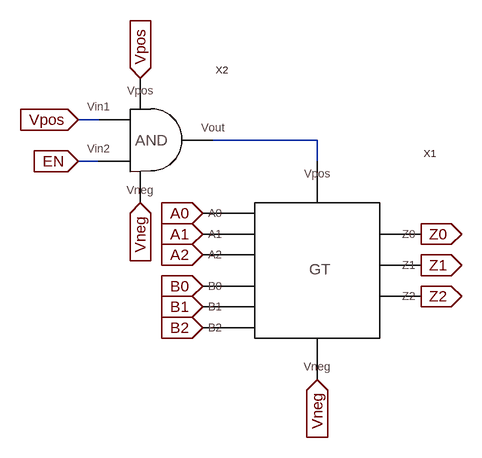
[diagram p0: schematic GT_EN_SYM.asc]
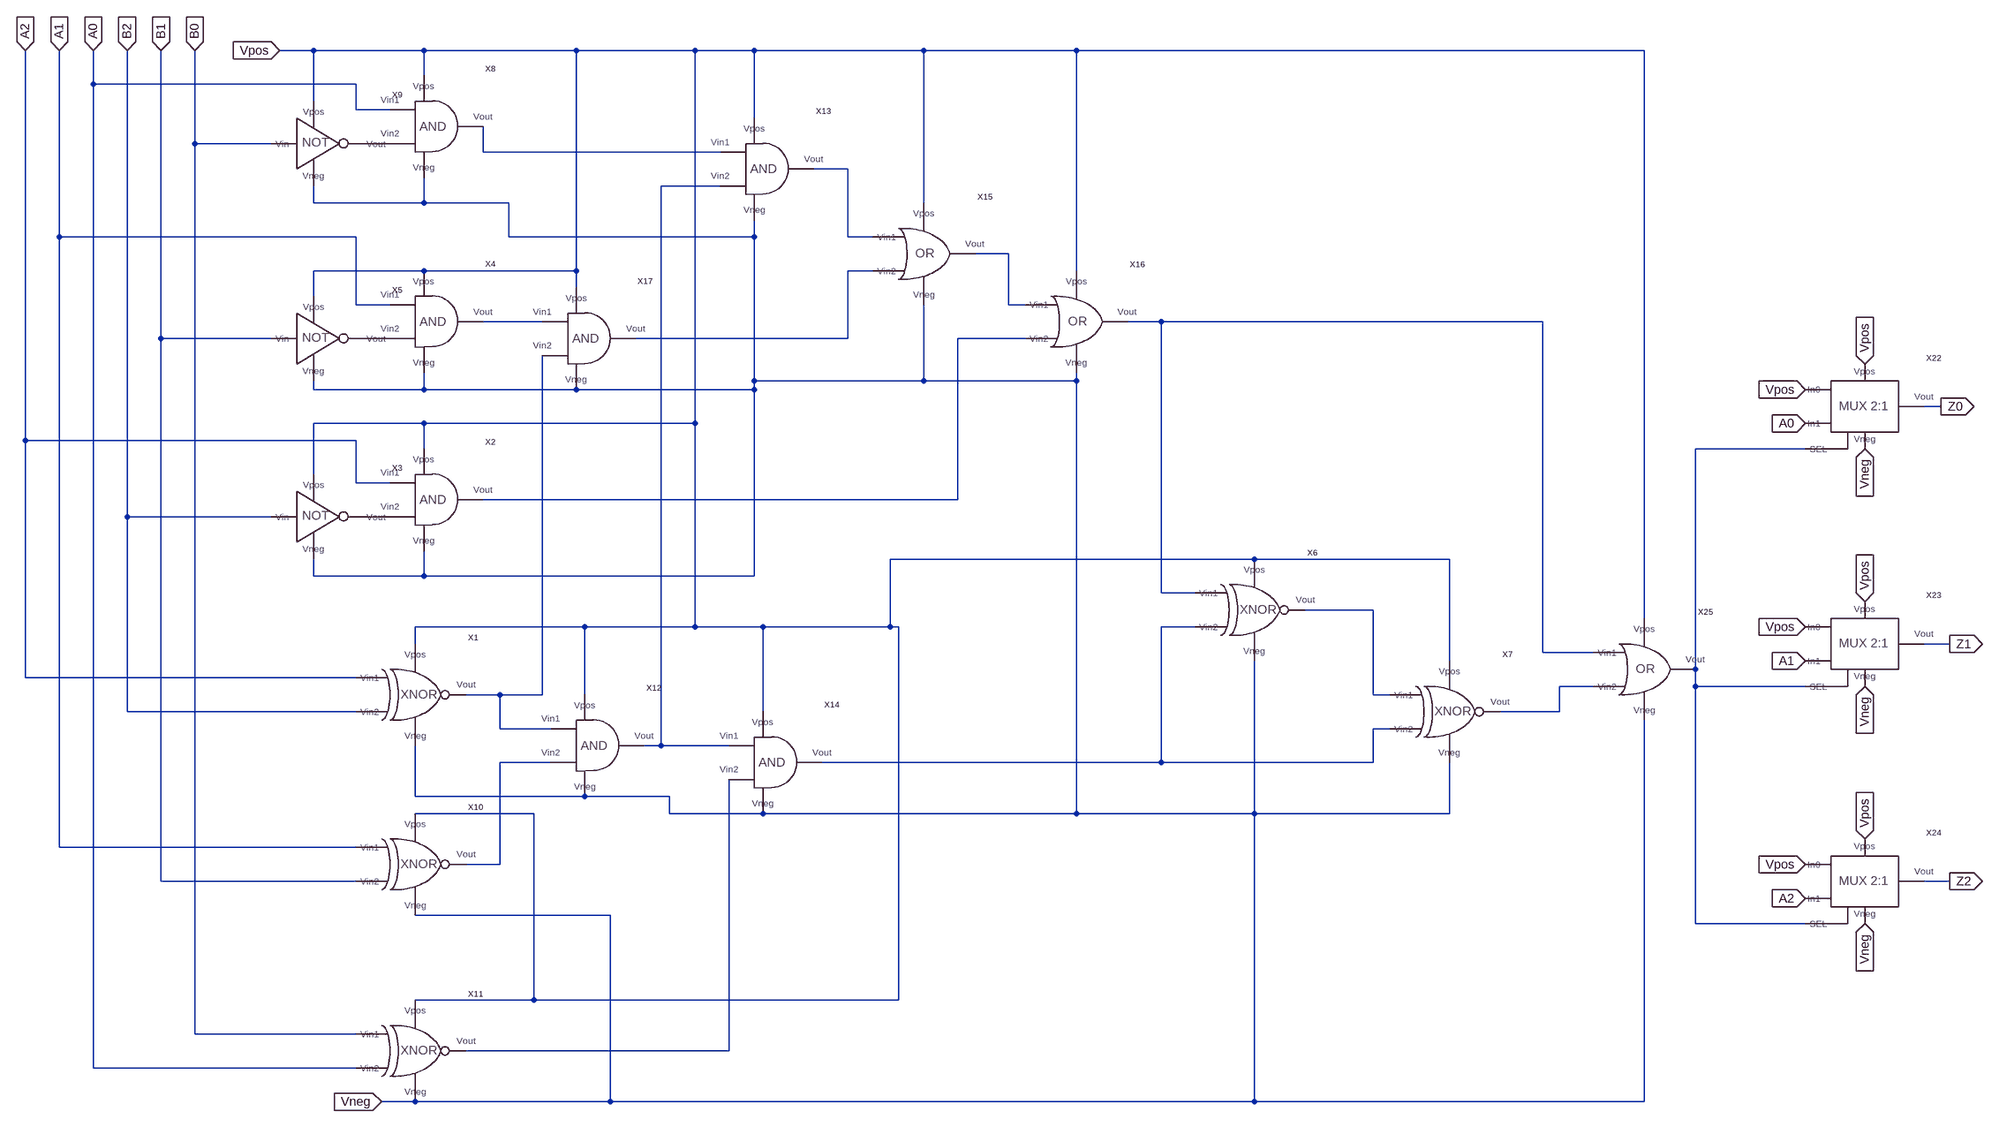
[diagram p1: sub-circuit gt_sym.asc]
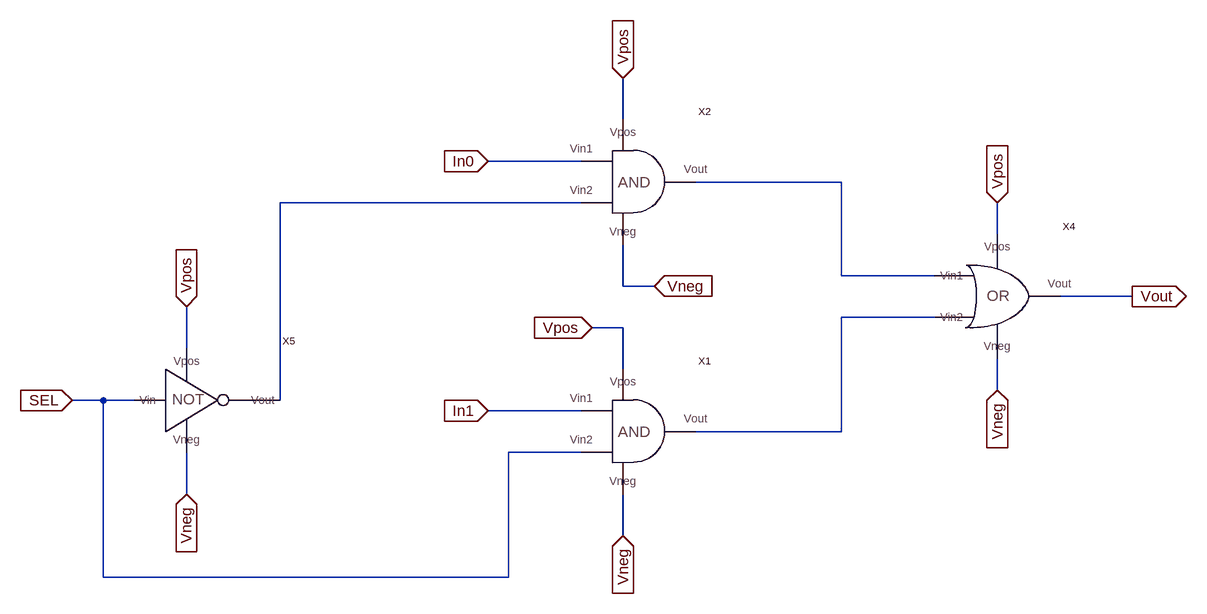
[diagram p2: sub-circuit mux2_1.asc]
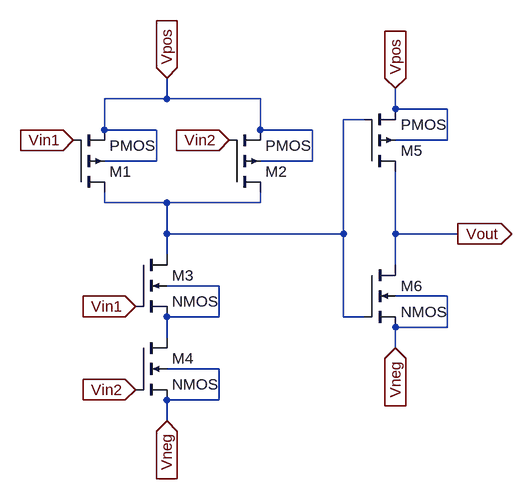
[diagram p3: sub-circuit and_sym.asc]
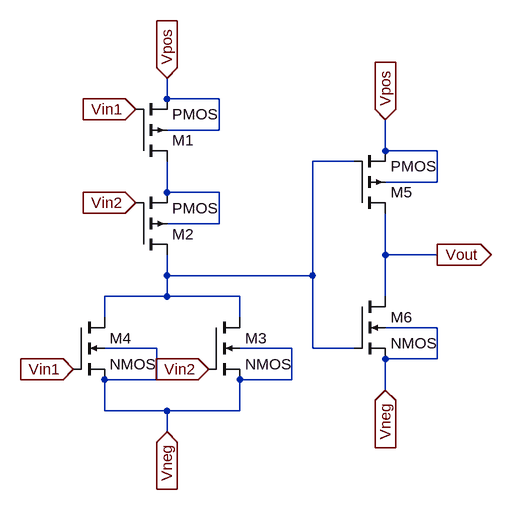
[diagram p4: sub-circuit or_sym.asc]
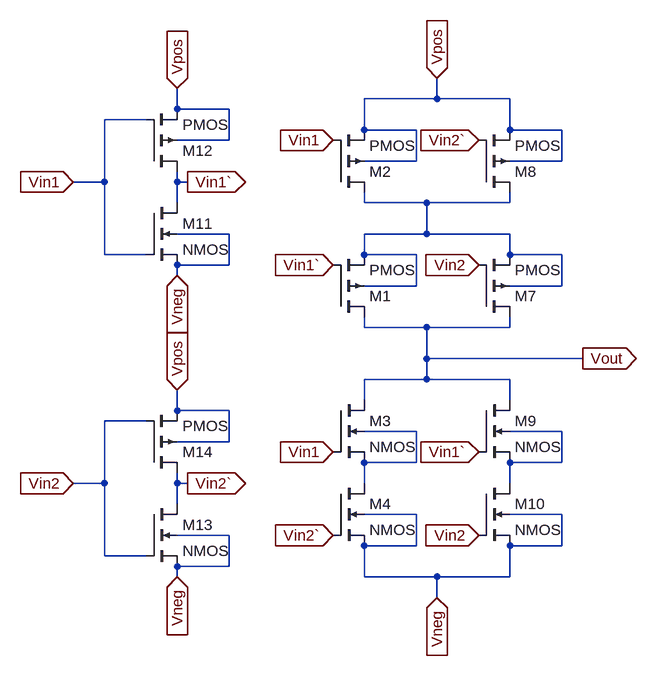
[diagram p5: sub-circuit xnor_sym.asc]
GT_EN_SYM.asc, the LTspice schematic file:
Version 4
SHEET 1 880 680
WIRE -48 -32 -80 -32
WIRE 288 0 128 0
WIRE -48 32 -80 32
WIRE 288 32 288 0
FLAG 112 112 A0
IOPIN 112 112 In
FLAG 112 144 A1
IOPIN 112 144 In
FLAG 112 176 A2
IOPIN 112 176 In
FLAG 112 224 B0
IOPIN 112 224 In
FLAG 112 256 B1
IOPIN 112 256 In
FLAG 112 288 B2
IOPIN 112 288 In
FLAG 288 368 Vneg
IOPIN 288 368 In
FLAG -80 -32 Vpos
IOPIN -80 -32 In
FLAG -80 32 EN
IOPIN -80 32 In
FLAG 16 -96 Vpos
IOPIN 16 -96 In
FLAG 16 96 Vneg
IOPIN 16 96 In
FLAG 448 144 Z0
IOPIN 448 144 Out
FLAG 448 192 Z1
IOPIN 448 192 Out
FLAG 448 240 Z2
IOPIN 448 240 Out
SYMBOL GT_SYM 288 208 R0
SYMATTR InstName X1
SYMBOL AND_SYM 32 0 R0
SYMATTR InstName X2

gt_sym.asc, the sub-circuit schematic file:
Version 4
SHEET 1 3832 2184
WIRE -32 128 -96 128
WIRE 176 128 -32 128
WIRE 464 128 176 128
WIRE 688 128 464 128
WIRE 800 128 688 128
WIRE 1120 128 800 128
WIRE 1408 128 1120 128
WIRE 2480 128 1408 128
WIRE 176 176 176 128
WIRE -448 192 -448 128
WIRE 48 192 -448 192
WIRE -32 224 -32 128
WIRE 48 240 48 192
WIRE 112 240 48 240
WIRE 800 256 800 128
WIRE -256 304 -256 128
WIRE -112 304 -256 304
WIRE 288 320 288 272
WIRE 736 320 288 320
WIRE 976 352 912 352
WIRE 736 384 624 384
WIRE -32 416 -32 384
WIRE 176 416 176 368
WIRE 176 416 -32 416
WIRE 336 416 176 416
WIRE 1120 416 1120 128
WIRE -512 480 -512 128
WIRE 48 480 -512 480
WIRE 336 480 336 416
WIRE 800 480 800 448
WIRE 800 480 336 480
WIRE 976 480 976 352
WIRE 1024 480 976 480
WIRE 1280 512 1216 512
WIRE 176 544 -32 544
WIRE 464 544 464 128
WIRE 464 544 176 544
WIRE 1024 544 976 544
WIRE 1408 544 1408 128
WIRE 464 576 464 544
WIRE -32 592 -32 544
WIRE 48 608 48 480
WIRE 112 608 48 608
WIRE 1280 608 1280 512
WIRE 1312 608 1280 608
WIRE 400 640 288 640
WIRE 1568 640 1504 640
WIRE 2288 640 1568 640
WIRE -320 672 -320 128
WIRE -112 672 -320 672
WIRE 976 672 976 544
WIRE 976 672 576 672
WIRE 1312 672 1184 672
WIRE 800 752 800 480
WIRE 1120 752 1120 608
WIRE 1120 752 800 752
WIRE 1408 752 1408 736
WIRE 1408 752 1120 752
WIRE -32 768 -32 752
WIRE 176 768 176 736
WIRE 176 768 -32 768
WIRE 464 768 176 768
WIRE 800 768 800 752
WIRE 800 768 464 768
WIRE 3040 800 3008 800
WIRE 176 832 -32 832
WIRE 688 832 688 128
WIRE 688 832 176 832
WIRE -576 864 -576 128
WIRE 48 864 -576 864
WIRE 176 880 176 832
WIRE 2784 880 2576 880
WIRE -32 928 -32 832
WIRE 48 944 48 864
WIRE 112 944 48 944
WIRE 1184 976 1184 672
WIRE 1184 976 288 976
WIRE -384 1008 -384 128
WIRE -112 1008 -384 1008
WIRE 1744 1088 1056 1088
WIRE 2112 1088 1744 1088
WIRE -32 1120 -32 1088
WIRE 176 1120 176 1072
WIRE 176 1120 -32 1120
WIRE 800 1120 800 768
WIRE 800 1120 176 1120
WIRE 1568 1152 1568 640
WIRE 1632 1152 1568 1152
WIRE 1968 1184 1840 1184
WIRE 2480 1200 2480 128
WIRE 480 1216 160 1216
WIRE 688 1216 688 832
WIRE 688 1216 480 1216
WIRE 816 1216 688 1216
WIRE 1056 1216 1056 1088
WIRE 1056 1216 816 1216
WIRE 1072 1216 1056 1216
WIRE 1632 1216 1568 1216
WIRE 160 1248 160 1216
WIRE 3056 1248 3008 1248
WIRE 2288 1264 2288 640
WIRE 2384 1264 2288 1264
WIRE 2112 1280 2112 1088
WIRE 2576 1296 2576 880
WIRE -576 1312 -576 864
WIRE 48 1312 -576 1312
WIRE 2384 1328 2320 1328
WIRE 2576 1328 2576 1296
WIRE 2784 1328 2576 1328
WIRE 320 1344 256 1344
WIRE 400 1344 400 704
WIRE 400 1344 320 1344
WIRE 480 1344 480 1216
WIRE 1968 1344 1968 1184
WIRE 2000 1344 1968 1344
WIRE -384 1376 -384 1008
WIRE 48 1376 -384 1376
WIRE 816 1376 816 1216
WIRE 2320 1376 2320 1328
WIRE 2320 1376 2208 1376
WIRE 320 1408 320 1344
WIRE 416 1408 320 1408
WIRE 2000 1408 1968 1408
WIRE 624 1440 624 384
WIRE 624 1440 592 1440
WIRE 752 1440 624 1440
WIRE 416 1472 320 1472
WIRE 1568 1472 1568 1216
WIRE 1568 1472 928 1472
WIRE 1968 1472 1968 1408
WIRE 1968 1472 1568 1472
WIRE 160 1536 160 1440
WIRE 480 1536 160 1536
WIRE 640 1536 480 1536
WIRE 384 1568 160 1568
WIRE 640 1568 640 1536
WIRE 816 1568 640 1568
WIRE 1408 1568 1408 752
WIRE 1408 1568 816 1568
WIRE 1744 1568 1744 1280
WIRE 1744 1568 1408 1568
WIRE 2112 1568 2112 1472
WIRE 2112 1568 1744 1568
WIRE -512 1632 -512 480
WIRE 48 1632 -512 1632
WIRE 320 1664 320 1472
WIRE 320 1664 256 1664
WIRE -320 1696 -320 672
WIRE 48 1696 -320 1696
WIRE 3056 1696 3008 1696
WIRE 528 1760 160 1760
WIRE 2576 1776 2576 1328
WIRE 2784 1776 2576 1776
WIRE 384 1920 384 1568
WIRE 384 1920 160 1920
WIRE 1072 1920 1072 1216
WIRE 1072 1920 384 1920
WIRE -256 1984 -256 304
WIRE 48 1984 -256 1984
WIRE 752 2016 752 1504
WIRE 752 2016 256 2016
WIRE -448 2048 -448 192
WIRE 48 2048 -448 2048
WIRE 160 2112 96 2112
WIRE 528 2112 528 1760
WIRE 528 2112 160 2112
WIRE 1744 2112 1744 1568
WIRE 1744 2112 528 2112
WIRE 2480 2112 2480 1392
WIRE 2480 2112 1744 2112
FLAG -576 128 A2
IOPIN -576 128 In
FLAG -512 128 A1
IOPIN -512 128 In
FLAG -448 128 A0
IOPIN -448 128 In
FLAG -384 128 B2
IOPIN -384 128 In
FLAG -320 128 B1
IOPIN -320 128 In
FLAG -256 128 B0
IOPIN -256 128 In
FLAG 3040 800 Z0
IOPIN 3040 800 Out
FLAG 3056 1248 Z1
IOPIN 3056 1248 Out
FLAG 3056 1696 Z2
IOPIN 3056 1696 Out
FLAG 2896 720 Vpos
IOPIN 2896 720 In
FLAG 2784 1728 A2
IOPIN 2784 1728 In
FLAG 2784 1280 A1
IOPIN 2784 1280 In
FLAG 2784 832 A0
IOPIN 2784 832 In
FLAG 2896 1168 Vpos
IOPIN 2896 1168 In
FLAG 2896 1616 Vpos
IOPIN 2896 1616 In
FLAG 2896 880 Vneg
IOPIN 2896 880 In
FLAG 2896 1328 Vneg
IOPIN 2896 1328 In
FLAG 2896 1776 Vneg
IOPIN 2896 1776 In
FLAG 2784 768 Vpos
IOPIN 2784 768 In
FLAG 2784 1216 Vpos
IOPIN 2784 1216 In
FLAG 2784 1664 Vpos
IOPIN 2784 1664 In
FLAG -96 128 Vpos
IOPIN -96 128 In
FLAG 96 2112 Vneg
IOPIN 96 2112 In
SYMBOL MUX2_1 2896 800 R0
SYMATTR InstName X22
SYMBOL MUX2_1 2896 1248 R0
SYMATTR InstName X23
SYMBOL MUX2_1 2896 1696 R0
SYMATTR InstName X24
SYMBOL OR_SYM 2496 1296 R0
SYMATTR InstName X25
SYMBOL XNOR_SYM 160 1344 R0
SYMATTR InstName X1
SYMBOL AND_SYM 192 976 R0
SYMATTR InstName X2
SYMBOL NOT_SYM -32 1008 R0
SYMATTR InstName X3
SYMBOL AND_SYM 192 640 R0
SYMATTR InstName X4
SYMBOL NOT_SYM -32 672 R0
SYMATTR InstName X5
SYMBOL AND_SYM 192 272 R0
SYMATTR InstName X8
SYMBOL NOT_SYM -32 304 R0
SYMATTR InstName X9
SYMBOL XNOR_SYM 160 1664 R0
SYMATTR InstName X10
SYMBOL XNOR_SYM 160 2016 R0
SYMATTR InstName X11
SYMBOL AND_SYM 496 1440 R0
SYMATTR InstName X12
SYMBOL AND_SYM 816 352 R0
SYMATTR InstName X13
SYMBOL AND_SYM 832 1472 R0
SYMATTR InstName X14
SYMBOL OR_SYM 1136 512 R0
SYMATTR InstName X15
SYMBOL OR_SYM 1424 640 R0
SYMATTR InstName X16
SYMBOL AND_SYM 480 672 R0
SYMATTR InstName X17
SYMBOL XNOR_SYM 1744 1184 R0
SYMATTR InstName X6
SYMBOL XNOR_SYM 2112 1376 R0
SYMATTR InstName X7

mux2_1.asc, the sub-circuit schematic file:
Version 4
SHEET 1 1072 680
WIRE 176 -352 176 -416
WIRE 112 -288 -32 -288
WIRE 512 -256 288 -256
WIRE 112 -224 -352 -224
WIRE 752 -176 752 -224
WIRE 512 -112 512 -256
WIRE 656 -112 512 -112
WIRE 176 -96 176 -160
WIRE 224 -96 176 -96
WIRE 960 -80 848 -80
WIRE 656 -48 512 -48
WIRE 176 -32 128 -32
WIRE -496 0 -496 -64
WIRE 176 32 176 -32
WIRE 752 64 752 16
WIRE -624 80 -672 80
WIRE -576 80 -624 80
WIRE -352 80 -352 -224
WIRE 112 96 -32 96
WIRE 512 128 512 -48
WIRE 512 128 288 128
WIRE 112 160 0 160
WIRE -496 224 -496 160
WIRE 176 288 176 224
WIRE -624 352 -624 80
WIRE 0 352 0 160
WIRE 0 352 -624 352
FLAG -32 -288 In0
IOPIN -32 -288 In
FLAG -32 96 In1
IOPIN -32 96 In
FLAG -672 80 SEL
IOPIN -672 80 In
FLAG 176 -416 Vpos
IOPIN 176 -416 In
FLAG 224 -96 Vneg
IOPIN 224 -96 In
FLAG 128 -32 Vpos
IOPIN 128 -32 In
FLAG 752 -224 Vpos
IOPIN 752 -224 In
FLAG 752 64 Vneg
IOPIN 752 64 In
FLAG 176 288 Vneg
IOPIN 176 288 In
FLAG -496 -64 Vpos
IOPIN -496 -64 In
FLAG -496 224 Vneg
IOPIN -496 224 In
FLAG 960 -80 Vout
IOPIN 960 -80 Out
SYMBOL AND_SYM 192 128 R0
SYMATTR InstName X1
SYMBOL AND_SYM 192 -256 R0
SYMATTR InstName X2
SYMBOL OR_SYM 768 -80 R0
SYMATTR InstName X4
SYMBOL NOT_SYM -496 80 R0
SYMATTR InstName X5

and_sym.asc, the sub-circuit schematic file:
Version 4
SHEET 1 880 680
WIRE 272 -16 272 -48
WIRE 272 -16 176 -16
WIRE 416 -16 272 -16
WIRE 624 0 624 -32
WIRE 704 0 624 0
WIRE 576 16 544 16
WIRE 176 32 176 -16
WIRE 256 32 176 32
WIRE 416 32 416 -16
WIRE 496 32 416 32
WIRE 704 48 704 0
WIRE 704 48 624 48
WIRE 256 80 256 32
WIRE 256 80 176 80
WIRE 496 80 496 32
WIRE 496 80 416 80
WIRE 176 144 176 128
WIRE 272 144 176 144
WIRE 416 144 416 128
WIRE 416 144 272 144
WIRE 272 192 272 144
WIRE 544 192 544 16
WIRE 544 192 272 192
WIRE 624 192 624 96
WIRE 720 192 624 192
WIRE 272 224 272 192
WIRE 624 240 624 192
WIRE 352 272 272 272
WIRE 704 288 624 288
WIRE 352 320 352 272
WIRE 352 320 272 320
WIRE 544 320 544 192
WIRE 576 320 544 320
WIRE 704 336 704 288
WIRE 704 336 624 336
WIRE 272 352 272 320
WIRE 624 368 624 336
WIRE 352 400 272 400
WIRE 352 448 352 400
WIRE 352 448 272 448
WIRE 272 480 272 448
FLAG 272 -48 Vpos
IOPIN 272 -48 In
FLAG 128 48 Vin1
IOPIN 128 48 In
FLAG 224 304 Vin1
IOPIN 224 304 In
FLAG 224 432 Vin2
IOPIN 224 432 In
FLAG 720 192 Vout
IOPIN 720 192 Out
FLAG 368 48 Vin2
IOPIN 368 48 In
FLAG 272 480 Vneg
IOPIN 272 480 In
FLAG 624 -32 Vpos
IOPIN 624 -32 In
FLAG 624 368 Vneg
IOPIN 624 368 In
SYMBOL pmos4 128 128 M180
SYMATTR InstName M1
SYMBOL pmos4 368 128 M180
SYMATTR InstName M2
SYMBOL nmos4 224 224 R0
SYMATTR InstName M3
SYMBOL nmos4 224 352 R0
SYMATTR InstName M4
SYMBOL pmos4 576 96 M180
SYMATTR InstName M5
SYMBOL nmos4 576 240 R0
SYMATTR InstName M6

or_sym.asc, the sub-circuit schematic file:
Version 4
SHEET 1 880 680
WIRE 128 -128 128 -160
WIRE 208 -128 128 -128
WIRE 208 -80 208 -128
WIRE 208 -80 128 -80
WIRE 464 -48 464 -96
WIRE 544 -48 464 -48
WIRE 416 -32 352 -32
WIRE 544 0 544 -48
WIRE 544 0 464 0
WIRE 128 16 128 -32
WIRE 208 16 128 16
WIRE 208 64 208 16
WIRE 208 64 128 64
WIRE 464 112 464 48
WIRE 544 112 464 112
WIRE 128 144 128 112
WIRE 352 144 352 -32
WIRE 352 144 128 144
WIRE 128 176 128 144
WIRE 128 176 32 176
WIRE 240 176 128 176
WIRE 464 176 464 112
WIRE 32 208 32 176
WIRE 240 208 240 176
WIRE 544 224 464 224
WIRE 112 256 32 256
WIRE 320 256 240 256
WIRE 352 256 352 144
WIRE 416 256 352 256
WIRE 544 272 544 224
WIRE 544 272 464 272
WIRE 112 304 112 256
WIRE 112 304 32 304
WIRE 320 304 320 256
WIRE 320 304 240 304
WIRE 464 320 464 272
WIRE 32 352 32 304
WIRE 128 352 32 352
WIRE 240 352 240 304
WIRE 240 352 128 352
WIRE 128 384 128 352
FLAG 128 -160 Vpos
IOPIN 128 -160 In
FLAG 128 384 Vneg
IOPIN 128 384 In
FLAG -16 288 Vin1
IOPIN -16 288 In
FLAG 192 288 Vin2
IOPIN 192 288 In
FLAG 80 -112 Vin1
IOPIN 80 -112 In
FLAG 80 32 Vin2
IOPIN 80 32 In
FLAG 544 112 Vout
IOPIN 544 112 Out
FLAG 464 -96 Vpos
IOPIN 464 -96 In
FLAG 464 320 Vneg
IOPIN 464 320 In
SYMBOL pmos4 80 -32 M180
SYMATTR InstName M1
SYMBOL pmos4 80 112 M180
SYMATTR InstName M2
SYMBOL nmos4 192 208 R0
SYMATTR InstName M3
SYMBOL nmos4 -16 208 R0
SYMATTR InstName M4
SYMBOL pmos4 416 48 M180
SYMATTR InstName M5
SYMBOL nmos4 416 176 R0
SYMATTR InstName M6

xnor_sym.asc, the sub-circuit schematic file:
Version 4
SHEET 1 880 756
WIRE 384 -128 384 -160
WIRE 384 -128 272 -128
WIRE 496 -128 384 -128
WIRE -16 -112 -16 -144
WIRE 64 -112 -16 -112
WIRE -64 -96 -128 -96
WIRE 272 -80 272 -128
WIRE 352 -80 272 -80
WIRE 496 -80 496 -128
WIRE 576 -80 496 -80
WIRE 64 -64 64 -112
WIRE 64 -64 -16 -64
WIRE 352 -32 352 -80
WIRE 352 -32 272 -32
WIRE 576 -32 576 -80
WIRE 576 -32 496 -32
WIRE -128 0 -128 -96
WIRE -128 0 -176 0
WIRE -16 0 -16 -16
WIRE 0 0 -16 0
WIRE -16 32 -16 0
WIRE 272 32 272 16
WIRE 368 32 272 32
WIRE 496 32 496 16
WIRE 496 32 368 32
WIRE 64 80 -16 80
WIRE 368 80 368 32
WIRE 368 80 272 80
WIRE 496 80 368 80
WIRE -128 112 -128 0
WIRE -64 112 -128 112
WIRE 272 112 272 80
WIRE 352 112 272 112
WIRE 496 112 496 80
WIRE 576 112 496 112
WIRE 64 128 64 80
WIRE 64 128 -16 128
WIRE -16 144 -16 128
WIRE 352 160 352 112
WIRE 352 160 272 160
WIRE 576 160 576 112
WIRE 576 160 496 160
WIRE 272 224 272 208
WIRE 368 224 272 224
WIRE 496 224 496 208
WIRE 496 224 368 224
WIRE 368 272 368 224
WIRE 608 272 368 272
WIRE 368 304 368 272
WIRE 368 304 272 304
WIRE 496 304 368 304
WIRE 272 336 272 304
WIRE 496 336 496 304
WIRE -16 352 -16 320
WIRE 64 352 -16 352
WIRE -64 368 -128 368
WIRE 352 384 272 384
WIRE 576 384 496 384
WIRE 64 400 64 352
WIRE 64 400 -16 400
WIRE 352 432 352 384
WIRE 352 432 272 432
WIRE 576 432 576 384
WIRE 576 432 496 432
WIRE -128 464 -128 368
WIRE -128 464 -176 464
WIRE -16 464 -16 448
WIRE 0 464 -16 464
WIRE 272 464 272 432
WIRE 496 464 496 432
WIRE -16 496 -16 464
WIRE 352 512 272 512
WIRE 576 512 496 512
WIRE 64 544 -16 544
WIRE 352 560 352 512
WIRE 352 560 272 560
WIRE 576 560 576 512
WIRE 576 560 496 560
WIRE -128 576 -128 464
WIRE -64 576 -128 576
WIRE 64 592 64 544
WIRE 64 592 -16 592
WIRE -16 608 -16 592
WIRE 272 608 272 560
WIRE 384 608 272 608
WIRE 496 608 496 560
WIRE 496 608 384 608
WIRE 384 640 384 608
FLAG 384 -160 Vpos
IOPIN 384 -160 In
FLAG -176 0 Vin1
IOPIN -176 0 In
FLAG 224 416 Vin1
IOPIN 224 416 In
FLAG -176 464 Vin2
IOPIN -176 464 In
FLAG 384 640 Vneg
IOPIN 384 640 In
FLAG 608 272 Vout
IOPIN 608 272 Out
FLAG 224 -64 Vin1
IOPIN 224 -64 In
FLAG -16 -144 Vpos
IOPIN -16 -144 In
FLAG -16 144 Vneg
IOPIN -16 144 In
FLAG 0 0 Vin1`
IOPIN 0 0 Out
FLAG -16 320 Vpos
IOPIN -16 320 In
FLAG -16 608 Vneg
IOPIN -16 608 In
FLAG 0 464 Vin2`
IOPIN 0 464 Out
FLAG 448 128 Vin2
IOPIN 448 128 In
FLAG 448 -64 Vin2`
IOPIN 448 -64 In
FLAG 224 128 Vin1`
IOPIN 224 128 In
FLAG 448 416 Vin1`
IOPIN 448 416 In
FLAG 224 544 Vin2`
IOPIN 224 544 In
FLAG 448 544 Vin2
IOPIN 448 544 In
SYMBOL pmos4 224 208 M180
SYMATTR InstName M1
SYMBOL pmos4 224 16 M180
SYMATTR InstName M2
SYMBOL nmos4 224 336 R0
SYMATTR InstName M3
SYMBOL nmos4 224 464 R0
SYMATTR InstName M4
SYMBOL pmos4 448 208 M180
SYMATTR InstName M7
SYMBOL pmos4 448 16 M180
SYMATTR InstName M8
SYMBOL nmos4 448 336 R0
SYMATTR InstName M9
SYMBOL nmos4 448 464 R0
SYMATTR InstName M10
SYMBOL nmos4 -64 32 R0
SYMATTR InstName M11
SYMBOL pmos4 -64 -16 M180
SYMATTR InstName M12
SYMBOL nmos4 -64 496 R0
SYMATTR InstName M13
SYMBOL pmos4 -64 448 M180
SYMATTR InstName M14

The netlist it stands for:
* GT_EN_SYM.asc
XX1 A0 A1 A2 B0 B1 B2 Z0 Z1 Z2 N001 Vneg gt_sym
XX2 Vpos EN Vpos Vneg N001 and_sym

* block symbol definitions
.subckt gt_sym A0 A1 A2 B0 B1 B2 Z0 Z1 Z2 Vpos Vneg
XX22 Vpos A0 N009 Vpos Vneg Z0 mux2_1
XX23 Vpos A1 N009 Vpos Vneg Z1 mux2_1
XX24 Vpos A2 N009 Vpos Vneg Z2 mux2_1
XX25 Vpos N007 N012 N009 Vneg or_sym
XX1 A2 B2 Vpos N013 Vneg xnor_sym
XX2 A2 P001 Vpos Vneg N008 and_sym
XX3 B2 Vpos P001 Vneg NOT_SYM  ; pins Vin Vpos Vout Vneg
XX4 A1 P002 Vpos Vneg N006 and_sym
XX5 B1 Vpos P002 Vneg NOT_SYM  ; pins Vin Vpos Vout Vneg
XX8 A0 P003 Vpos Vneg N001 and_sym
XX9 B0 Vpos P003 Vneg NOT_SYM  ; pins Vin Vpos Vout Vneg
XX10 A1 B1 Vpos N014 Vneg xnor_sym
XX11 B0 A0 Vpos N015 Vneg xnor_sym
XX12 N013 N014 Vpos Vneg N003 and_sym
XX13 N001 N003 Vpos Vneg N002 and_sym
XX14 N003 N015 Vpos Vneg N011 and_sym
XX15 Vpos N002 N005 N004 Vneg or_sym
XX16 Vpos N004 N008 N007 Vneg or_sym
XX17 N006 N013 Vpos Vneg N005 and_sym
XX6 N007 N011 Vpos N010 Vneg xnor_sym
XX7 N010 N011 Vpos N012 Vneg xnor_sym
.ends gt_sym

.subckt mux2_1 In0 In1 SEL Vpos Vneg Vout
XX1 In1 SEL Vpos Vneg N003 and_sym
XX2 In0 N002 Vpos Vneg N001 and_sym
XX4 Vpos N001 N003 Vout Vneg or_sym
XX5 SEL Vpos N002 Vneg NOT_SYM  ; pins Vin Vpos Vout Vneg
.ends mux2_1

.subckt and_sym Vin1 Vin2 Vpos Vneg Vout
M1 N001 Vin1 Vpos Vpos PMOS
M2 N001 Vin2 Vpos Vpos PMOS
M3 N001 Vin1 N002 N002 NMOS
M4 N002 Vin2 Vneg Vneg NMOS
M5 Vout N001 Vpos Vpos PMOS
M6 Vout N001 Vneg Vneg NMOS
.ends and_sym

.subckt or_sym Vpos Vin1 Vin2 Vout Vneg
M1 N002 Vin1 Vpos Vpos PMOS
M2 N001 Vin2 N002 N002 PMOS
M3 N001 Vin2 Vneg Vneg NMOS
M4 N001 Vin1 Vneg Vneg NMOS
M5 Vout N001 Vpos Vpos PMOS
M6 Vout N001 Vneg Vneg NMOS
.ends or_sym

.subckt xnor_sym Vin1 Vin2 Vpos Vout Vneg
M1 Vout Vin1` N001 N001 PMOS
M2 N001 Vin1 Vpos Vpos PMOS
M3 Vout Vin1 N002 N002 NMOS
M4 N002 Vin2` Vneg Vneg NMOS
M7 Vout Vin2 N001 N001 PMOS
M8 N001 Vin2` Vpos Vpos PMOS
M9 Vout Vin1` N003 N003 NMOS
M10 N003 Vin2 Vneg Vneg NMOS
M11 Vin1` Vin1 Vneg Vneg NMOS
M12 Vin1` Vin1 Vpos Vpos PMOS
M13 Vin2` Vin2 Vneg Vneg NMOS
M14 Vin2` Vin2 Vpos Vpos PMOS
.ends xnor_sym

.model NMOS NMOS
.model PMOS PMOS
.lib standard.mos
.backanno
.end